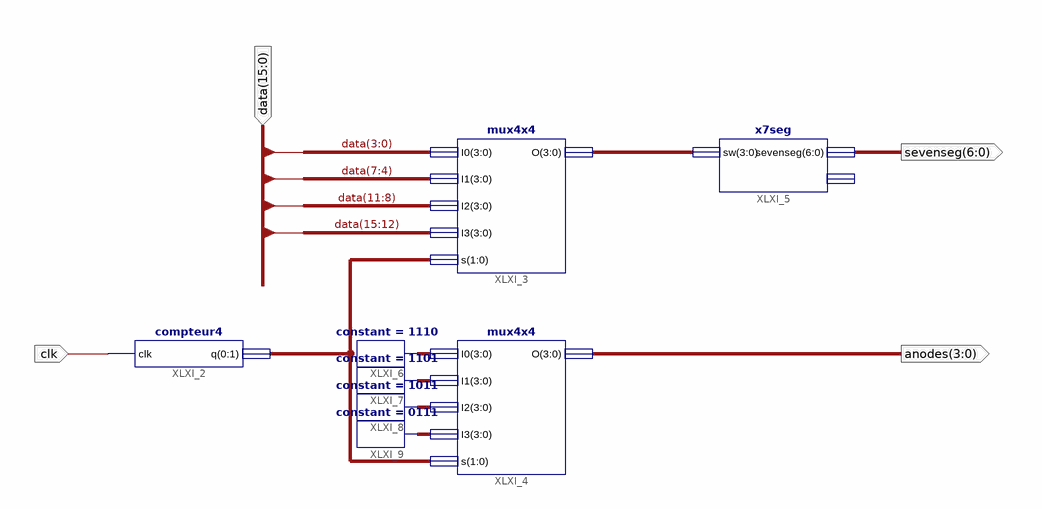
[diagram p0: schematic sheet 1]
// Xilinx ISE schematic afficheur16.sch (spartan3e) as structural Verilog: 8 symbols, 4 ports
module afficheur16 (
  input  [15:0] data,
  input  clk,
  output [3:0] anodes,
  output [6:0] sevenseg
);

  wire [1:0] XLXN_7;
  wire [3:0] XLXN_8, XLXN_12, XLXN_13, XLXN_14, XLXN_15;

  compteur4 XLXI_2 (.clk(clk), .q(XLXN_7));
  mux4x4 XLXI_3 (.I0(data[3:0]), .I1(data[7:4]), .I2(data[11:8]), .I3(data[15:12]), .s(XLXN_7), .O(XLXN_8));
  mux4x4 XLXI_4 (.I0(XLXN_12), .I1(XLXN_13), .I2(XLXN_14), .I3(XLXN_15), .s(XLXN_7), .O(anodes));
  x7seg XLXI_5 (.sw(XLXN_8), .sevenseg(sevenseg));  // open: anodes
  constant #(.CValue("1110")) XLXI_6 (.O(XLXN_12));
  constant #(.CValue("1101")) XLXI_7 (.O(XLXN_13));
  constant #(.CValue("1011")) XLXI_8 (.O(XLXN_14));
  constant #(.CValue("0111")) XLXI_9 (.O(XLXN_15));
endmodule
